# Altium schematic sheet MotorControllerBackPlane.SchDoc
size Legal
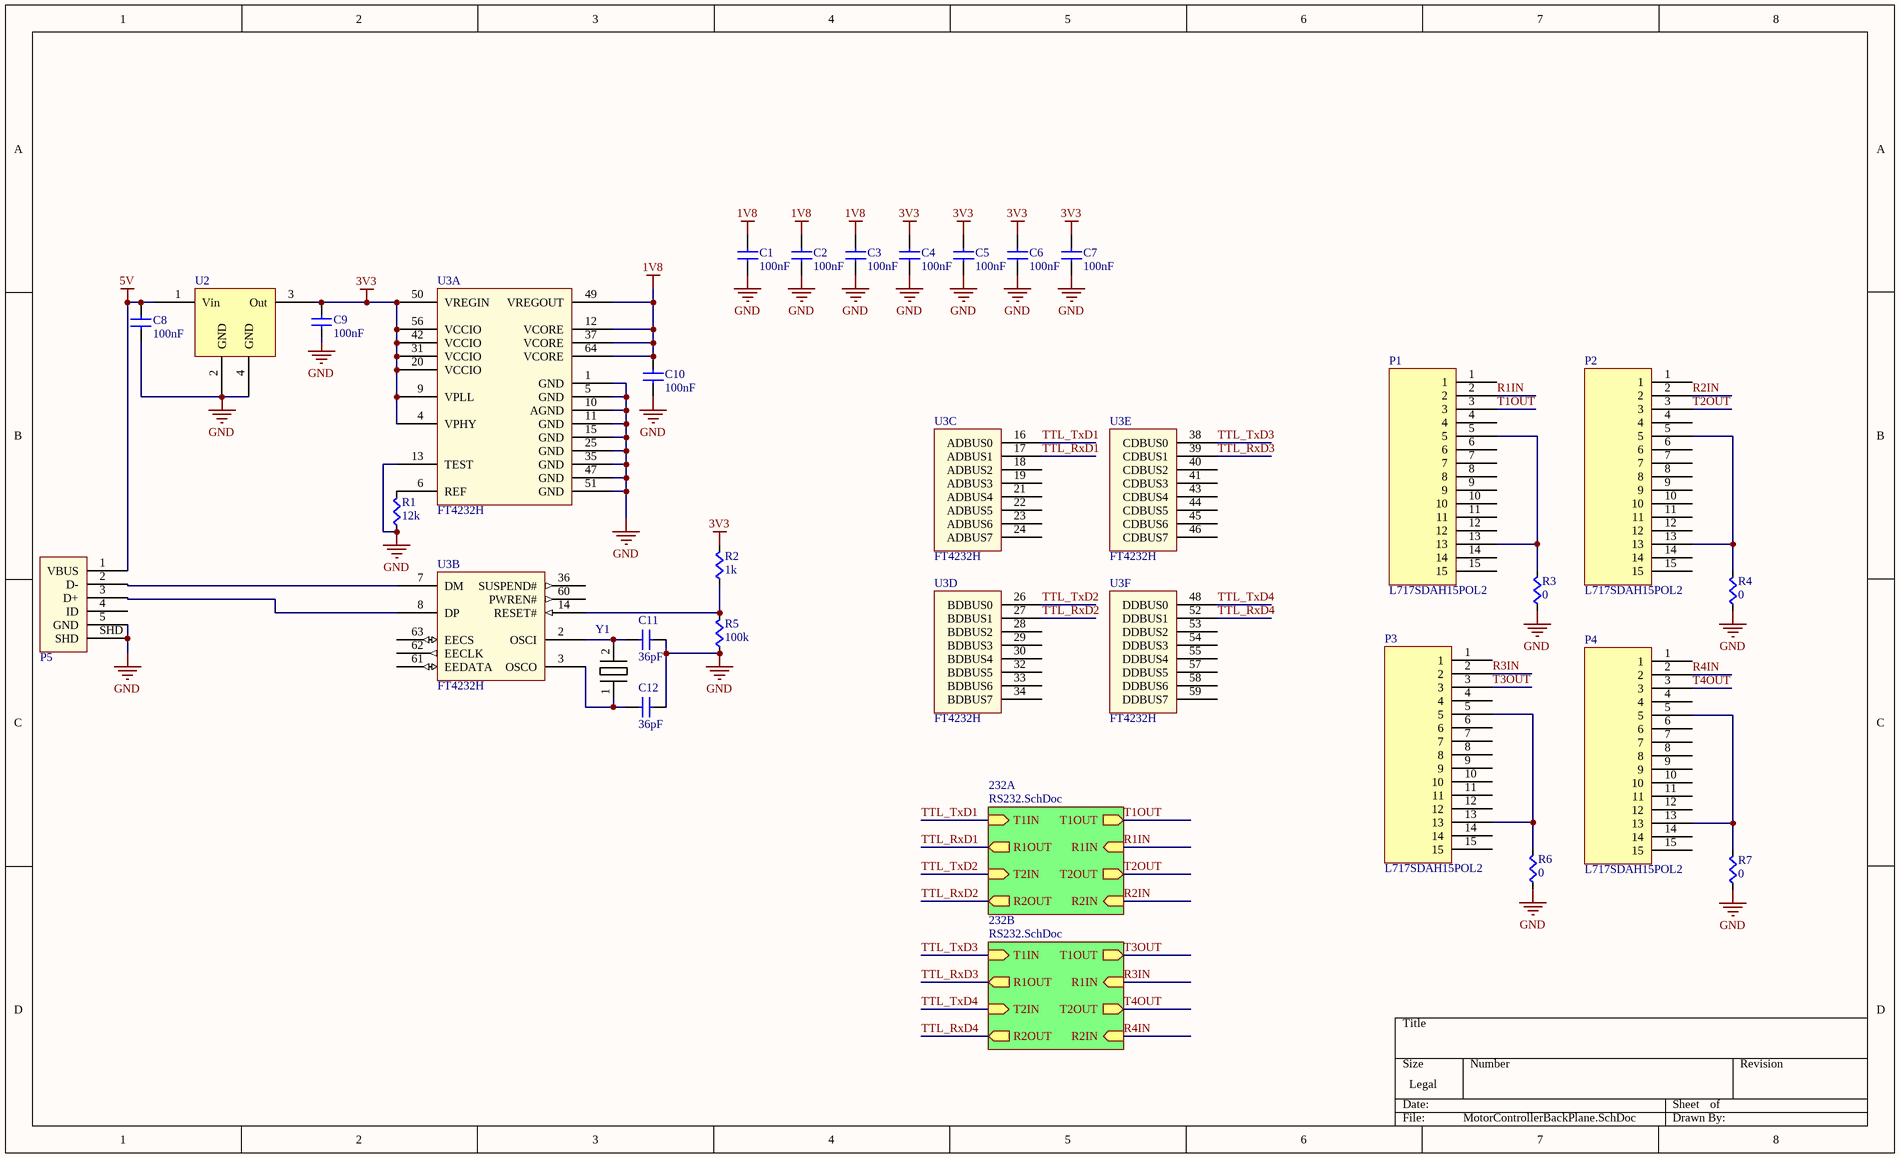
[diagram p0: MotorControllerBackPlane.SchDoc]

## Parts
C1  value 100nF  [CAPC0603]  (hidden comment: Cap)
C2  value 100nF  [CAPC0603]  (hidden comment: Cap)
C3  value 100nF  [CAPC0603]  (hidden comment: Cap)
C4  value 100nF  [CAPC0603]  (hidden comment: Cap)
C5  value 100nF  [CAPC0603]  (hidden comment: Cap)
C6  value 100nF  [CAPC0603]  (hidden comment: Cap)
C7  value 100nF  [CAPC0603]  (hidden comment: Cap)
C8  value 100nF  [CAPC0603]  (hidden comment: Cap)
C9  value 100nF  [CAPC0603]  (hidden comment: Cap)
C10  value 100nF  [CAPC0603]  (hidden comment: Cap)
C11  value 36pF  [CAPC0603]  (hidden comment: Cap)
C12  value 36pF  [CAPC0603]  (hidden comment: Cap)
P1  L717SDAH15POL2  [L717SDAH15POL2]
P2  L717SDAH15POL2  [L717SDAH15POL2]
P3  L717SDAH15POL2  [L717SDAH15POL2]
P4  L717SDAH15POL2  [L717SDAH15POL2]
P5  UX60SC-MB-5ST  [UX60SC-MB-5ST]  (value not drawn)
R1  value 12k  [RES0603]  (hidden comment: Res)
R2  value 1k  [RES0603]  (hidden comment: Res)
R3  value 0  [RES0603]  (hidden comment: Res)
R4  value 0  [RES0603]  (hidden comment: Res)
R5  value 100k  [RES0603]  (hidden comment: Res)
R6  value 0  [RES0603]  (hidden comment: Res)
R7  value 0  [RES0603]  (hidden comment: Res)
U2  3.3V LDO Reg  [SOT23-4n]  (value not drawn)
U3  FT4232H  [FT4232HL]  (parts A,B,C,D,E,F of 6)
Y1  ABLS2-12.000MHZ-D4Y-T  [HC49/US]  (value not drawn)

## Sub-sheets
232A = RS232.SchDoc: T1IN (in), T2IN (in), R1OUT (out), R2OUT (out), T1OUT (out), T2OUT (out), R1IN (in), R2IN (in)
232B = RS232.SchDoc: T1IN (in), T2IN (in), R1OUT (out), R2OUT (out), T1OUT (out), T2OUT (out), R1IN (in), R2IN (in)

## Nets
1V8: C1.1(A) C2.1(A) C3.1(A) C10.1(A) U3.12(VCORE) U3.37(VCORE) U3.49(VREGOUT) U3.64(VCORE)
3V3: C4.1(A) C5.1(A) C6.1(A) C7.1(A) C9.1(A) R2.1(A) U2.3(Out) U3.4(VPHY) U3.9(VPLL) U3.20(VCCIO) U3.31(VCCIO) U3.42(VCCIO) U3.50(VREGIN) U3.56(VCCIO)
5V: C8.1(A) P5.1(VBUS) U2.1(Vin)
GND: C1.2(B) C2.2(B) C3.2(B) C4.2(B) C5.2(B) C6.2(B) C7.2(B) C8.2(B) C9.2(B) C10.2(B) C11.2(B) C12.2(B) P5.5(GND) P5.SHD R1.2(B) R3.2(B) R4.2(B) R5.2(B) R6.2(B) R7.2(B) U2.2(GND) U2.4(GND) U3.1(GND) U3.5(GND) U3.10(AGND) U3.11(GND) U3.13(TEST) U3.15(GND) U3.25(GND) U3.35(GND) U3.47(GND) U3.51(GND)
R1IN: P1.2 ; sheet 232A/R1IN
R2IN: P2.2 ; sheet 232A/R2IN
R3IN: P3.2 ; sheet 232B/R1IN
R4IN: P4.2 ; sheet 232B/R2IN
T1OUT: P1.3 ; sheet 232A/T1OUT
T2OUT: P2.3 ; sheet 232A/T2OUT
T3OUT: P3.3 ; sheet 232B/T1OUT
T4OUT: P4.3 ; sheet 232B/T2OUT
TTL_RxD1: U3.17(ADBUS1) ; sheet 232A/R1OUT
TTL_RxD2: U3.27(BDBUS1) ; sheet 232A/R2OUT
TTL_RxD3: U3.39(CDBUS1) ; sheet 232B/R1OUT
TTL_RxD4: U3.52(DDBUS1) ; sheet 232B/R2OUT
TTL_TxD1: U3.16(ADBUS0) ; sheet 232A/T1IN
TTL_TxD2: U3.26(BDBUS0) ; sheet 232A/T2IN
TTL_TxD3: U3.38(CDBUS0) ; sheet 232B/T1IN
TTL_TxD4: U3.48(DDBUS0) ; sheet 232B/T2IN
NetC11_1: C11.1(A) U3.2(OSCI) Y1.2
NetC12_1: C12.1(A) U3.3(OSCO) Y1.1
NetP1_5: P1.5 P1.13 R3.1(A)
NetP2_5: P2.5 P2.13 R4.1(A)
NetP3_5: P3.5 P3.13 R6.1(A)
NetP4_5: P4.5 P4.13 R7.1(A)
NetP5_2: P5.2(D-) U3.7(DM)
NetP5_3: P5.3(D+) U3.8(DP)
NetR1_1: R1.1(A) U3.6(REF)
NetR2_2: R2.2(B) R5.1(A) U3.14(RESET#)

Not connected (* = marked no-connect by the designer): P1 1 4 6 7 8 9 10 11 12 14 15; P2 1 4 6 7 8 9 10 11 12 14 15; P3 1 4 6 7 8 9 10 11 12 14 15; P4 1 4 6 7 8 9 10 11 12 14 15; P5 4(ID); U3 18(ADBUS2) 19(ADBUS3) 21(ADBUS4) 22(ADBUS5) 23(ADBUS6) 24(ADBUS7) 28(BDBUS2) 29(BDBUS3) 30(BDBUS4) 32(BDBUS5) 33(BDBUS6) 34(BDBUS7) 36(SUSPEND#) 40(CDBUS2) 41(CDBUS3) 43(CDBUS4) 44(CDBUS5) 45(CDBUS6) 46(CDBUS7) 53(DDBUS2) 54(DDBUS3) 55(DDBUS4) 57(DDBUS5) 58(DDBUS6) 59(DDBUS7) 60(PWREN#) 61(EEDATA) 62(EECLK) 63(EECS)

## Library data of the parts
P1-P4 = L717SDAH15POL2: CONN D-SUB PLUG 15POS VERT SLDR; Manufacturer 1: Amphenol Commercial Products; ComponentLink1Description: Datasheet; ComponentLink1URL: https://cdn.amphenol-icc.com/media/wysiwyg/files/documentation/datasheet/cmio/d_df_machined_standard_density_dsub.pdf; Supplier 1: Digi-Key; Supplier Part Number 1: L717SDAH15POL2-ND; Manufacturer Part Number 1: L717SDAH15POL2
P5 = UX60SC-MB-5ST: USB Mini B Metal Shield SMT; Supplier 1: Digi-Key; Supplier Part Number 1: H11671CT-ND
U2 = LM3940IMPX-3.3: IC REG LDO 3.3V 1A SOT223; Supplier 1: Digi-Key; Supplier Part Number 1: LM3940IMPX-3.3/NOPBCT-ND
U3 = FT4232H: Quad High Speed USB to Multipurpose UART/MPSSE; Supplier 1: Digi-Key; Supplier Part Number 1: 768-1026-1-ND
Y1 = ABLS2-12.000MHZ-D4Y-T: 12MHz ±30ppm Crystal 18pF 50 Ohm -40°C ~ 85°C Surface Mount HC49/US; Supplier 1: Digi-Key; Supplier Part Number 1: 535-9869-1-ND
C1-C12 = Cap: Supplier 1: Digi-Key; Supplier Part Number 1: 1276-1000-1-ND
R1-R7 = Res: Supplier 1: Digi-Key
  R1 R2 R5: Supplier Part Number 1: RMCF0603JT10K0CT-ND